# EAGLE design MicroD-25 Breakout board (EAGLE 9.5.2)
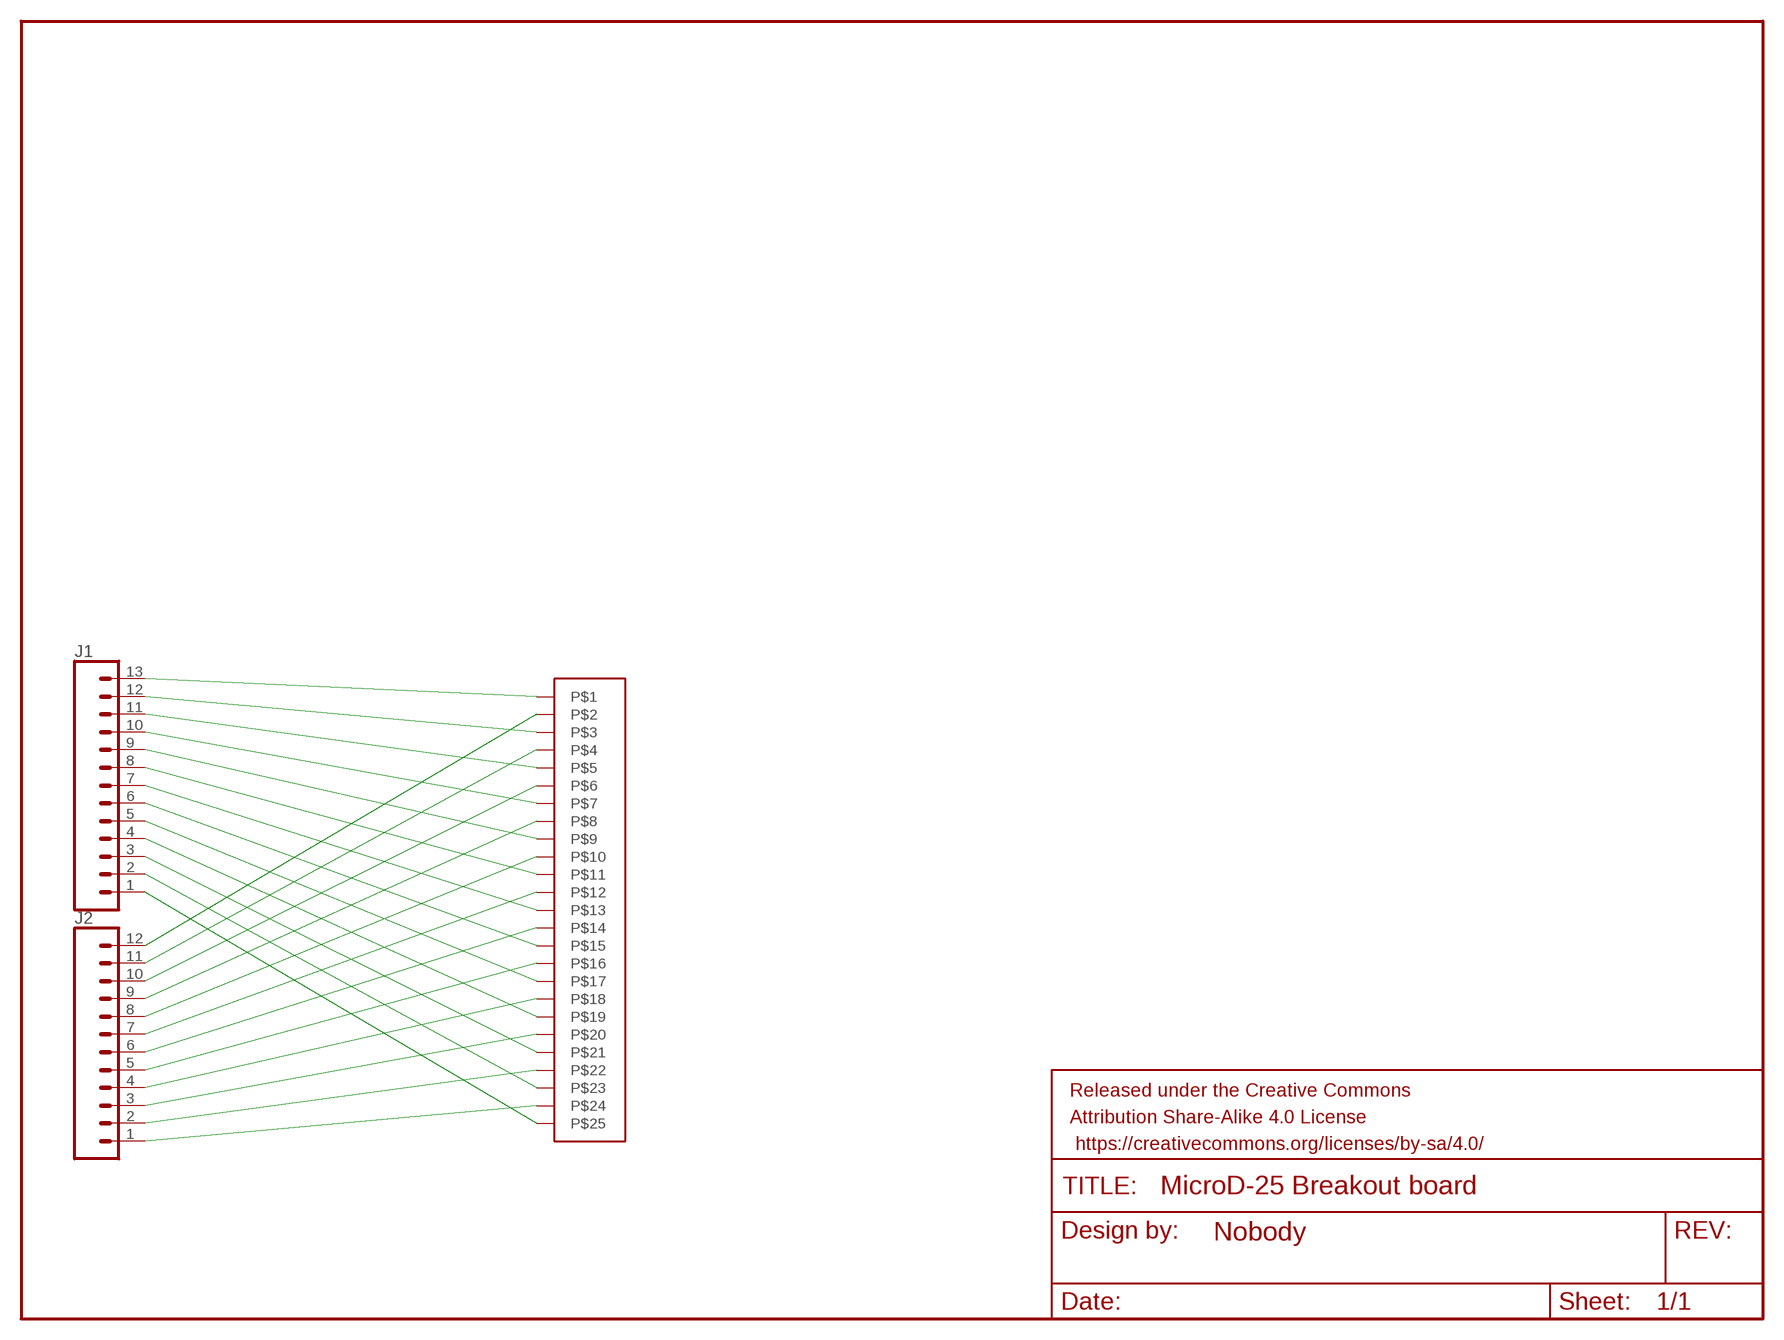
[diagram p0: schematic, sheet 1]

## Parts
FRAME1  FRAME-LETTERNO_PACKAGE  [DUMMY]
J1  CONN_13LONGPADS  [1X13-LONGPADS]
J2  CONN_12LONGPADS  [1X12_LONGPADS]
U$1  MICROD25_FM_RCPT  [MICROD25_FM_RCPT]

## Nets
N$1: J1.13 U$1.PIN1
N$2: J1.12 U$1.PIN3
N$3: J1.11 U$1.PIN5
N$4: J1.10 U$1.PIN7
N$5: J1.9 U$1.PIN9
N$6: J1.8 U$1.PIN11
N$7: J1.7 U$1.PIN13
N$8: J1.6 U$1.PIN15
N$9: J1.5 U$1.PIN17
N$10: J1.4 U$1.PIN19
N$11: J1.3 U$1.PIN21
N$12: J1.2 U$1.PIN23
N$13: J1.1 U$1.PIN25
N$14: J2.12 U$1.PIN2
N$15: J2.11 U$1.PIN4
N$16: J2.10 U$1.PIN6
N$17: J2.9 U$1.PIN8
N$18: J2.8 U$1.PIN10
N$19: J2.7 U$1.PIN12
N$20: J2.6 U$1.PIN14
N$21: J2.5 U$1.PIN16
N$22: J2.4 U$1.PIN18
N$23: J2.3 U$1.PIN20
N$24: J2.2 U$1.PIN22
N$25: J2.1 U$1.PIN24

## Library data of the parts
FRAME1 = SparkFun-Aesthetics:FRAME-LETTER: Schematic Frame - Letter Standard 8.5x11 US Letter frame; DESIGNER: Nobody; VERSION: v01
J1 = SparkFun-Connectors:CONN_13: Multi connection point. Often used as Generic Header-pin footprint for 0.1 inch spaced/style header connections On any of the 0.1 inch spaced packages, you can populate with these: Break Away Headers - Straight <https://www.sparkfun.com/products/116> (PRT-00116) Break Away Male Headers - Right Angle <https://www.sparkfun.com/products/553> (PRT-00553) Female Headers <https://www.sparkfun.com/products/115> (PRT-00115) Break Away Headers - Machine Pin <https://www.sparkfun.com/products/117> (PRT-00117) Break Away Female Headers - Swiss Machine Pin <https://www.sparkfun.com/products/743> (PRT-00743) For SCREWTERMINALS and SPRING TERMINALS visit here: Screw Terimnals on SparkFun.com <https://www.sparkfun.com/search/results?term=Screw+Terminals> (5mm/3.5mm/2.54mm spacing) This device is also useful as a general connection point to wire up your design to another part of your project. Our various solder wires solder well into these plated through hole pads. Hook-Up Wire - Assortment (Stranded, 22 AWG) <https://www.sparkfun.com/products/11375> (PRT-11375) Hook-Up Wire - Assortment (Solid Core, 22 AWG) <https://www.sparkfun.com/products/11367> (PRT-11367) View the entire wire category on our website here <https://www.sparkfun.com/categories/141> Special notes: Molex polarized connector foot print use with SKU : PRT-08231 with associated crimp pins and housings. 1MM SMD Version SKU: PRT-10208 NOTES ON THE VARIANTS LOCK and LOCK_LONGPADS... This footprint was designed to help hold the alignment of a through-hole component (i.e. 6-pin header) while soldering it into place. You may notice that each hole has been shifted either up or down by 0.005 of an inch from it's more standard position (which is a perfectly straight line). This slight alteration caused the pins (the squares in the middle) to touch the edges of the holes. Because they are alternating, it causes a "brace" to hold the component in place. 0.005 has proven to be the perfect amount of "off-center" position when using our standard breakaway headers. Although looks a little odd when you look at the bare footprint, once you have a header in there, the alteration is very hard to notice. Also,if you push a header all the way into place, it is covered up entirely on the bottom side.
J2 = SparkFun-Connectors:CONN_12: Multi connection point. Often used as Generic Header-pin footprint for 0.1 inch spaced/style header connections On any of the 0.1 inch spaced packages, you can populate with these: Break Away Headers - Straight <https://www.sparkfun.com/products/116> (PRT-00116) Break Away Male Headers - Right Angle <https://www.sparkfun.com/products/553> (PRT-00553) Female Headers <https://www.sparkfun.com/products/115> (PRT-00115) Break Away Headers - Machine Pin <https://www.sparkfun.com/products/117> (PRT-00117) Break Away Female Headers - Swiss Machine Pin <https://www.sparkfun.com/products/743> (PRT-00743) For SCREWTERMINALS and SPRING TERMINALS visit here: Screw Terimnals on SparkFun.com <https://www.sparkfun.com/search/results?term=Screw+Terminals> (5mm/3.5mm/2.54mm spacing) This device is also useful as a general connection point to wire up your design to another part of your project. Our various solder wires solder well into these plated through hole pads. Hook-Up Wire - Assortment (Stranded, 22 AWG) <https://www.sparkfun.com/products/11375> (PRT-11375) Hook-Up Wire - Assortment (Solid Core, 22 AWG) <https://www.sparkfun.com/products/11367> (PRT-11367) View the entire wire category on our website here <https://www.sparkfun.com/categories/141> Special notes: Molex polarized connector foot print use with SKU : PRT-08231 with associated crimp pins and housings. 1MM SMD Version SKU: PRT-10208 NOTES ON THE VARIANTS LOCK and LOCK_LONGPADS... This footprint was designed to help hold the alignment of a through-hole component (i.e. 6-pin header) while soldering it into place. You may notice that each hole has been shifted either up or down by 0.005 of an inch from it's more standard position (which is a perfectly straight line). This slight alteration caused the pins (the squares in the middle) to touch the edges of the holes. Because they are alternating, it causes a "brace" to hold the component in place. 0.005 has proven to be the perfect amount of "off-center" position when using our standard breakaway headers. Although looks a little odd when you look at the bare footprint, once you have a header in there, the alteration is very hard to notice. Also,if you push a header all the way into place, it is covered up entirely on the bottom side.
U$1 = Braly2:MICROD25_FM_RCPT

## Board
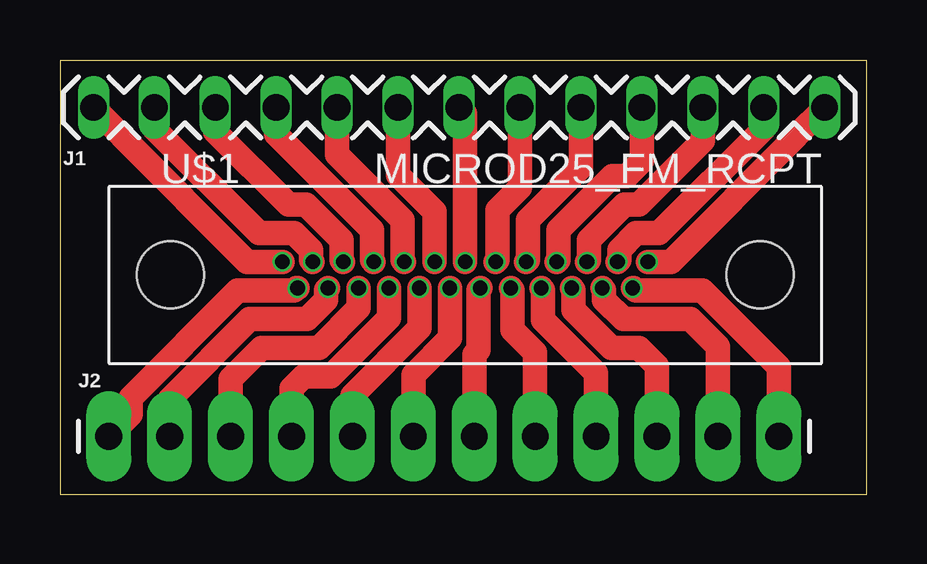
[diagram p1: board, top side]

Size 33.63 x 18.09 mm. Coordinates in mm from the lower left corner, seen from the top.
Outline: 0,0 33.63,0 33.63,18.09 0,18.09 0,0
Copper layers (1*16): Top 0.0356mm / dielectric 1.5011mm / Bottom 0.0356mm
Design rules "SilverCircuits": minimum track width 7mil, minimum drill 10mil, track to track 7mil, track to pad 7mil, pad to pad 7mil, via to via 7mil, smd to smd 0mil, copper to edge 10mil, drill to drill 10mil, minimum pad ring 4mil, minimum via ring 8mil, stop-mask expansion 4mil, vias tented up to drill 0mil, thermal gap 10mil

### Footprints (pad centres in the part's own frame; a part is rotated, then mirrored left to right if it is on the bottom)
1X13-LONGPADS = drill 1.118 long: 1 0,0; 2 2.54,0; 3 5.08,0; 4 7.62,0; 5 10.16,0; 6 12.7,0; 7 15.24,0; 8 17.78,0; 9 20.32,0; 10 22.86,0; 11 25.4,0; 12 27.94,0; 13 30.48,0
1X12_LONGPADS = drill 1.118 pad 1.88 long: 1 0,0; 2 2.54,0; 3 5.08,0; 4 7.62,0; 5 10.16,0; 6 12.7,0; 7 15.24,0; 8 17.78,0; 9 20.32,0; 10 22.86,0; 11 25.4,0; 12 27.94,0
MICROD25_FM_RCPT = drill 0.61: PIN1 7.62,0.546; PIN2 6.985,-0.546; PIN3 6.35,0.546; PIN4 5.715,-0.546; PIN5 5.08,0.546; PIN6 4.445,-0.546; PIN7 3.81,0.546; PIN8 3.175,-0.546; PIN9 2.54,0.546; PIN10 1.905,-0.546; PIN11 1.27,0.546; PIN12 0.635,-0.546; PIN13 0,0.546; PIN14 -0.635,-0.546; PIN15 -1.27,0.546; PIN16 -1.905,-0.546; PIN17 -2.54,0.546; PIN18 -3.175,-0.546; PIN19 -3.81,0.546; PIN20 -4.445,-0.546; PIN21 -5.08,0.546; PIN22 -5.715,-0.546; PIN23 -6.35,0.546; PIN24 -6.985,-0.546; PIN25 -7.62,0.546 | hole 2.794: -12.294,0; 12.294,0

### Placement (x,y rotation side)
FRAME1  0,0 0 top
J1  1.4,16.13 0 top
J2  2.03,2.41 0 top
U$1  16.89,9.14 0 top

### Tracks (layer width: path | path; a pad name or v marks a point on that pad's centre or on a via)
N$1
  Top 1.016: J1.13 30.68,14.94 30.68,14.91 25.46,9.69 U$1.PIN1
N$2
  Top 1.016: U$1.PIN3 23.32,9.77 23.32,10.19 24.02,10.88 24.97,10.88 29.34,15.25 J1.12
N$3
  Top 1.016: U$1.PIN5 22.05,9.77 22.05,10.6 23.52,12.08 24.13,12.08 26.8,14.74 J1.11
N$4
  Top 1.016: U$1.PIN7 20.78,9.77 20.78,11.02 23.03,13.27 23.64,13.27 24.26,13.89 J1.10
N$5
  Top 1.016: U$1.PIN9 19.51,9.77 19.51,11.44 21.72,13.65 J1.9
N$6
  Top 1.016: U$1.PIN11 18.24,9.77 18.24,11.86 19.18,12.8 J1.8
N$7
  Top 1.016: U$1.PIN13 16.89,15.88 J1.7
N$8
  Top 1.016: U$1.PIN15 15.62,11.78 14.1,13.31 J1.6
N$9
  Top 1.016: U$1.PIN17 14.28,9.77 14.28,11.44 11.56,14.16 J1.5
N$10
  Top 1.016: U$1.PIN19 13.01,9.77 13.01,11.02 9.02,15.01 J1.4
N$11
  Top 1.016: U$1.PIN21 11.73,9.77 11.73,10.6 10.26,12.08 9.53,12.08 6.48,15.13 J1.3
N$12
  Top 1.016: U$1.PIN23 10.46,9.77 10.46,10.19 9.77,10.88 8.31,10.88 3.94,15.25 J1.2
N$13
  Top 1.016: J1.1 2.59,14.94 2.59,14.91 7.81,9.69 U$1.PIN25
N$14
  Top 1.016: J2.12 29.97,5.3 26.78,8.5 24.02,8.5 23.91,8.6 U$1.PIN2
N$15
  Top 1.016: J2.11 27.43,6.16 26.29,7.3 23.48,7.3 22.68,8.1 22.68,8.52 U$1.PIN4
N$16
  Top 1.016: J2.10 24.89,5.35 24.13,6.11 22.99,6.11 21.41,7.68 21.41,8.52 U$1.PIN6
N$17
  Top 1.016: J2.9 22.35,5.06 20.14,7.27 20.14,8.52 U$1.PIN8
N$18
  Top 1.016: J2.8 19.81,5.91 18.87,6.85 18.87,8.52 U$1.PIN10
N$19
  Top 1.016: J2.7 17.27,5.83 17.45,6.01 17.45,8.52 U$1.PIN12
N$20
  Top 1.016: J2.6 14.73,4.98 16.26,6.51 U$1.PIN14
N$21
  Top 1.016: J2.5 12.19,4.13 14.99,6.92 U$1.PIN16
N$22
  Top 1.016: J2.4 9.65,4.41 10.16,4.92 11.29,4.92 13.72,7.34 U$1.PIN18
N$23
  Top 1.016: J2.3 7.11,4.82 8.41,6.11 10.79,6.11 12.45,7.76 U$1.PIN20
N$24
  Top 1.016: J2.2 4.57,3.96 7.91,7.3 10.3,7.3 11.1,8.1 11.1,8.52 U$1.PIN22
N$25
  Top 1.016: J2.1 2.95,3.33 2.95,4.03 7.42,8.5 9.77,8.5 9.87,8.6 U$1.PIN24